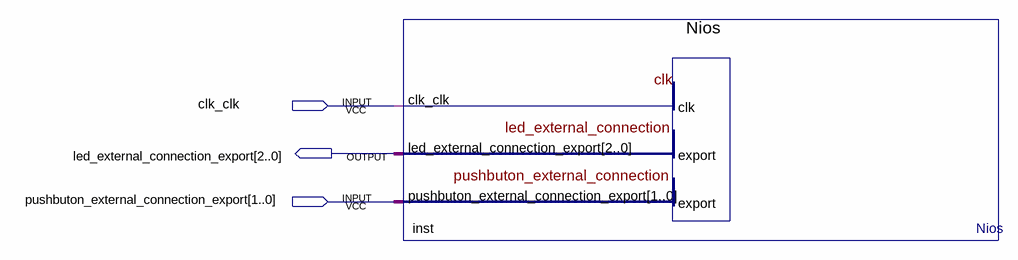
[diagram p0: schematic sheet]
// Quartus schematic TOP.bdf as structural Verilog: 1 symbols, 3 pins
module TOP (
  input  clk_clk,
  input  [1:0] pushbuton_external_connection_export,
  output [2:0] led_external_connection_export
);

  Nios inst (
    .clk_clk(clk_clk), .pushbuton_external_connection_export(pushbuton_external_connection_export),
    .led_external_connection_export(led_external_connection_export));
endmodule
